# Altium schematic sheet Programmable_Delay_Line.SchDoc
size A4; ApprovedBy: Mateusz Kowalik; CheckedBy: Mateusz Kowalik; Author: Mateusz Kowalik; CompanyName: InMotion Labs sp. z o.o.; DrawnBy: Mateusz Kowalik; Engineer: Mateusz Kowalik; Organization: InMotion Labs sp. z o.o.; Address1: Rydlówka 5A; Address2: 30-363 Kraków; Address4: Poland; DocumentNumber: 10; Revision: Rev 0; SheetNumber: 9; SheetTotal: 17
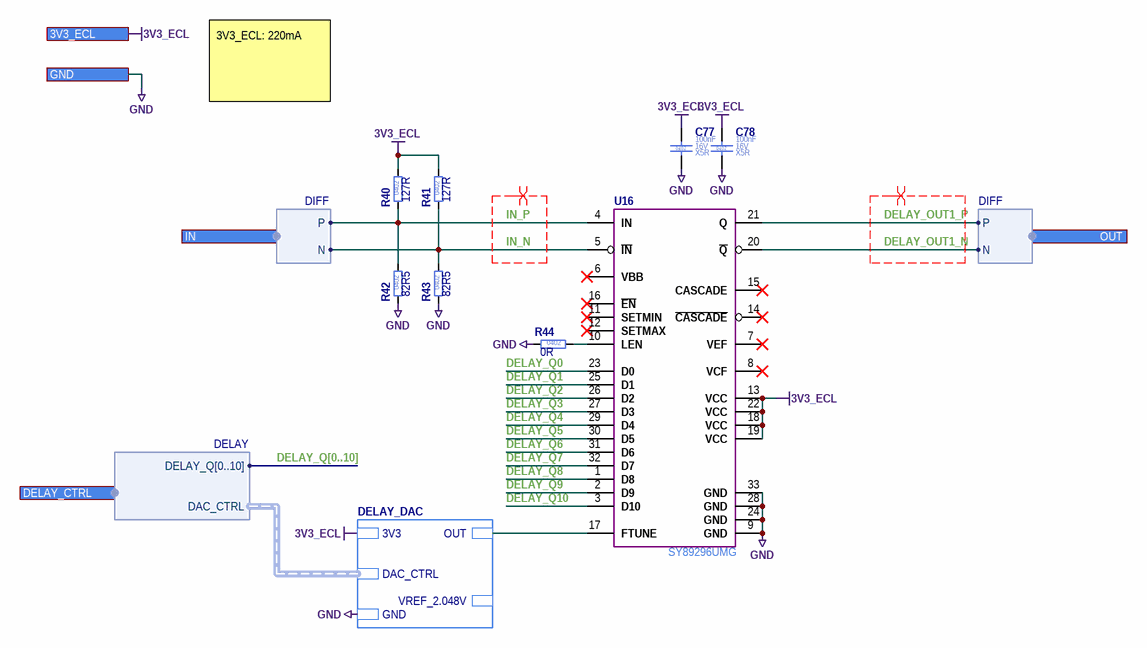
[diagram p0: Programmable_Delay_Line.SchDoc]

## Parts
C77  Case/Package: 0402  Voltage Rating (DC): 16V  Dielectric: X5R  Capacitance: 100nF  [C_0402_1005]  (hidden comment: C_100NF_16V_X5R_0402_10)
C78  Case/Package: 0402  Voltage Rating (DC): 16V  Dielectric: X5R  Capacitance: 100nF  [C_0402_1005]  (hidden comment: C_100NF_16V_X5R_0402_10)
R40  Resistance: 127R  Case/Package: 0402  [R_0402_1005]  (hidden comment: R_127R_0402_1)
R41  Resistance: 127R  Case/Package: 0402  [R_0402_1005]  (hidden comment: R_127R_0402_1)
R42  Resistance: 82R5  Case/Package: 0402  [R_0402_1005]  (hidden comment: R_82R5_0402_1)
R43  Resistance: 82R5  Case/Package: 0402  [R_0402_1005]  (hidden comment: R_82R5_0402_1)
R44  Resistance: 0R  Case/Package: 0402  [R_0402_1005]  (hidden comment: R_0R_0402_1)
U16  SY89296UMG  [QFN50P500X500X100_HS-33N]

## Sub-sheets
DELAY_DAC = DAC_12bit.SchDoc: 3V3, DAC_CTRL (harness DAC), VREF_2.048V, OUT, GND

## Ports
3V3_ECL, DELAY_CTRL (harness DELAY), GND, IN (harness DIFF), OUT (harness DIFF)

## Harnesses
DIFF: P, N
DELAY: DELAY_Q[0..10], DAC_CTRL

## Nets
3V3_ECL: C77.1 C78.1 R40.2 R41.2 U16.13(VCC) U16.18(VCC) U16.19(VCC) U16.22(VCC) ; port 3V3_ECL, sheet DELAY_DAC/3V3
GND: C77.2 C78.2 R42.1 R43.1 R44.1 U16.9(GND) U16.24(GND) U16.28(GND) U16.33(GND) ; port GND, sheet DELAY_DAC/GND
DELAY_OUT1_N: U16.20(~{Q}) ; port OUT.N
DELAY_OUT1_P: U16.21(Q) ; port OUT.P
DELAY_Q0: U16.23(D0)
DELAY_Q1: U16.25(D1)
DELAY_Q2: U16.26(D2)
DELAY_Q3: U16.27(D3)
DELAY_Q4: U16.29(D4)
DELAY_Q5: U16.30(D5)
DELAY_Q6: U16.31(D6)
DELAY_Q7: U16.32(D7)
DELAY_Q8: U16.1(D8)
DELAY_Q9: U16.2(D9)
DELAY_Q10: U16.3(D10)
IN_N: R41.1 R43.2 U16.5(~{IN}) ; port IN.N
IN_P: R40.1 R42.2 U16.4(IN) ; port IN.P
NetR44_2: R44.2 U16.10(LEN)
NetU16_17: U16.17(FTUNE) ; sheet DELAY_DAC/OUT

Not connected (* = marked no-connect by the designer): U16 6(VBB)* 7(VEF)* 8(VCF)* 11(SETMIN)* 12(SETMAX)* 14(~{CASCADE})* 15(CASCADE)* 16(~{EN})*

## Buses and harness runs
bus DELAY_Q[0..10]

## Layout directives
differential pair; differential pair class D100; net class D100: DELAY_OUT1_N, DELAY_OUT1_P, IN_N, IN_P

## Notes on the sheet
- 3V3_ECL: 220mA
- Title
- Size:
- Date:
- A4

## Library data of the parts
C77 C78 = C_100NF_16V_X5R_0402_10: Ceramic Capacitor; Manufacturer Part Number: EMK105BJ104KV-F; Manufacturer: Taiyo Yuden; Value: 100nF; Tolerance: 10%; Part Number: C_100NF_16V_X5R_0402_10; Mount: Surface Mount; Height: 500um; HelpURL: http://datasheet.octopart.com/EMK105BJ104KV-F-Taiyo-Yuden-datasheet-8857305.pdf; RoHS: Compliant; Max Operating Temperature: 125°C; Status: MK; Supplier 1: Mouser; Supplier Part Number 1: 963-EMK105BJ104KV-F; Manufacturer 2: Samsung Electro-Mechanics; Manufacturer Part Number 2: CL05B104KO5NNNC; Supplier 2: LCSC; Supplier Part Number 2: C1525
R40 R41 = R_127R_0402_1: Thick Film Resistor; Manufacturer: Yageo; Manufacturer Part Number: RC0402FR-07127RL; Value: 127R; Tolerance: 1%; Voltage Rating (DC): 50V; Power Rating: 63mW; Stats: MK; Part Number: R_127R_0402_1; Mount: Surface Mount; Height: 350um; HelpURL: https://pl.mouser.com/datasheet/2/447/PYu_RC_Group_51_RoHS_L_10-1664068.pdf; RoHS: Compliant; Max Operating Temperature: 155°C; Supplier 1: Mouser; Supplier Part Number 1: 603-RC0402FR-07127RL; Manufacturer 2: Uniroyal Elec; Manufacturer Part Number 2: 0402WGF1270TCE; Supplier 2: LCSC; Supplier Part Number 2: C247127
R42 R43 = R_82R5_0402_1: Thick Film Resistor; Manufacturer: Yageo; Manufacturer Part Number: RC0402FR-0782R5L; Value: 82R5; Tolerance: 1%; Voltage Rating (DC): 50V; Power Rating: 63mW; Stats: MK; Part Number: R_82R5_0402_1; Mount: Surface Mount; Height: 350um; HelpURL: https://pl.mouser.com/datasheet/2/447/PYu-RC_Group_51_RoHS_L_10-1527934.pdf; RoHS: Compliant; Max Operating Temperature: 155°C; Supplier 1: Mouser; Supplier Part Number 1: 603-RC0402FR-0782R5L; Manufacturer 2: Uniroyal Elec; Manufacturer Part Number 2: 0402WGF825JTCE; Supplier 2: LCSC; Supplier Part Number 2: C52037
R44 = R_0R_0402_1: Thick Film Resistor; Manufacturer: Yageo; Manufacturer Part Number: RC0402FR-070RL; Value: 0R; Tolerance: 1%; Voltage Rating (DC): 50V; Power Rating: 63mW; Stats: MK; Part Number: R_0R_0402_1; Mount: Surface Mount; Height: 350um; HelpURL: http://datasheet.octopart.com/2176049-1-TE-Connectivity---AMP-datasheet-11120217.pdf; RoHS: Compliant; Max Operating Temperature: 155°C; Supplier 1: Mouser; Supplier Part Number 1: 603-RC0402FR-070RL; Manufacturer 2: Uniroyal Elec; Manufacturer Part Number 2: 0402WGF0000TCE; Supplier 2: LCSC; Supplier Part Number 2: C17168
U16 = SY89296UMG: Delay Lines/Timing Elements 2.5V/3.3V PECL Delay Line; Manufacturer: Microchip; Max Frequency: 1.5GHz; Max Supply Current: 220mA; Max Supply Voltage: 3.6V; Min Supply Voltage: 2.375V; Part Number: SY89296UMG; Case/Package: QFN32; Mount: Surface Mount; Height: 0.9mm; HelpURL: https://datasheet.octopart.com/SY89296UTG-Microchip-datasheet-11975343.pdf; Logic Function: Delay Line; Marking: SY89296U; Max Operating Temperature: 85°C; Number of Pins: 32; RoHS: Compliant; Status: MK; Manufacturer Part Number: SY89296UMG; Supplier 1: Mouser; Supplier Part Number 1: 998-SY89296UMG